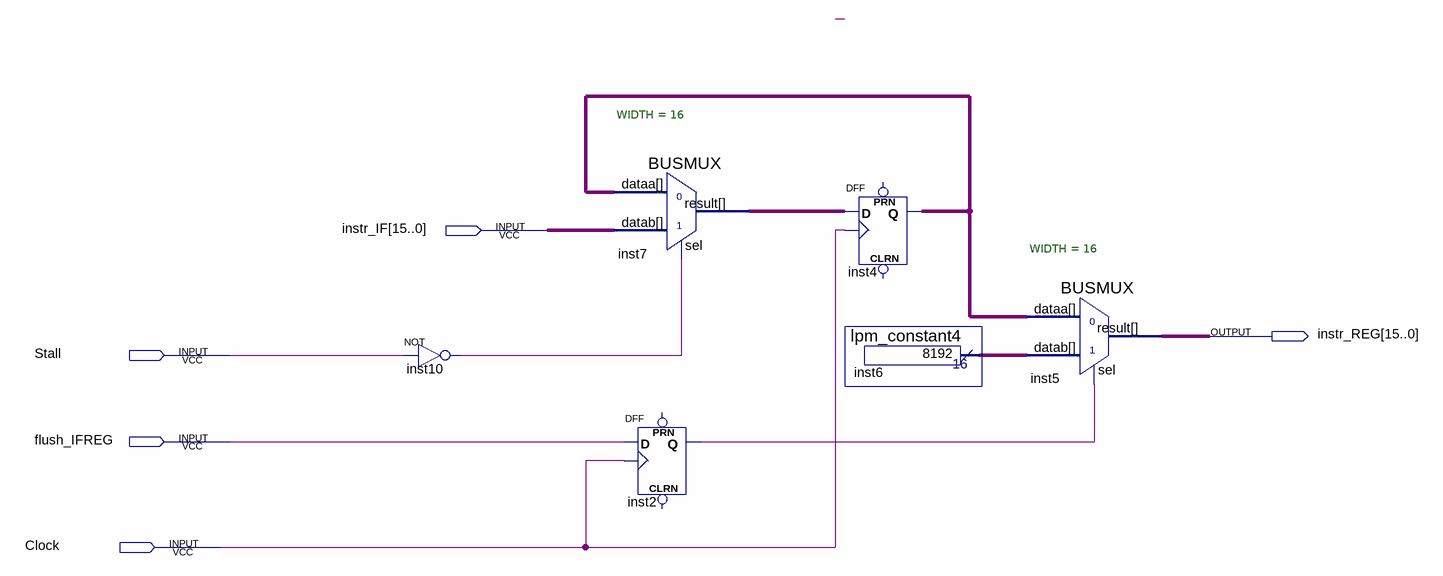
[diagram p0: schematic sheet]
// Quartus schematic IFREG.bdf as structural Verilog: 6 symbols, 5 pins
module IFREG (
  input  [15:0] instr_IF,
  input  Stall,
  input  flush_IFREG,
  input  Clock,
  output [15:0] instr_REG
);

  wire inst2_q, inst10_out;
  wire [15:0] inst4_q, inst6_result, inst7_result;

  not inst10 (inst10_out, Stall);
  BUSMUX #(.WIDTH(16)) inst7 (.datab(instr_IF), .sel(inst10_out), .dataa(inst4_q), .result(inst7_result));
  DFF inst2 (.CLK(Clock), .D(flush_IFREG), .Q(inst2_q));  // open: CLRN, PRN
  DFF inst4[15:0] (.CLK(Clock), .D(inst7_result), .Q(inst4_q));  // open: CLRN, PRN
  lpm_constant4 inst6 (.result(inst6_result));
  BUSMUX #(.WIDTH(16)) inst5 (.datab(inst6_result), .sel(inst2_q), .dataa(inst4_q), .result(instr_REG));
endmodule
